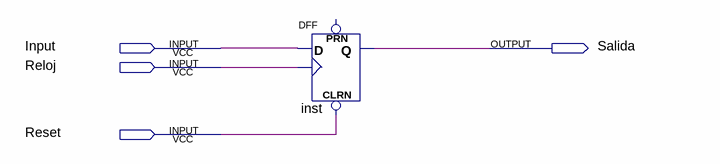
[diagram p0: schematic sheet]
// Quartus schematic FlipFlopD.bdf as structural Verilog: 1 symbols, 4 pins
module FlipFlopD (
  input  Input,
  input  Reloj,
  input  Reset,
  output Salida
);

  DFF inst (.CLRN(Reset), .CLK(Reloj), .D(Input), .Q(Salida));  // open: PRN
endmodule
